# EAGLE design interface (EAGLE 5.04)
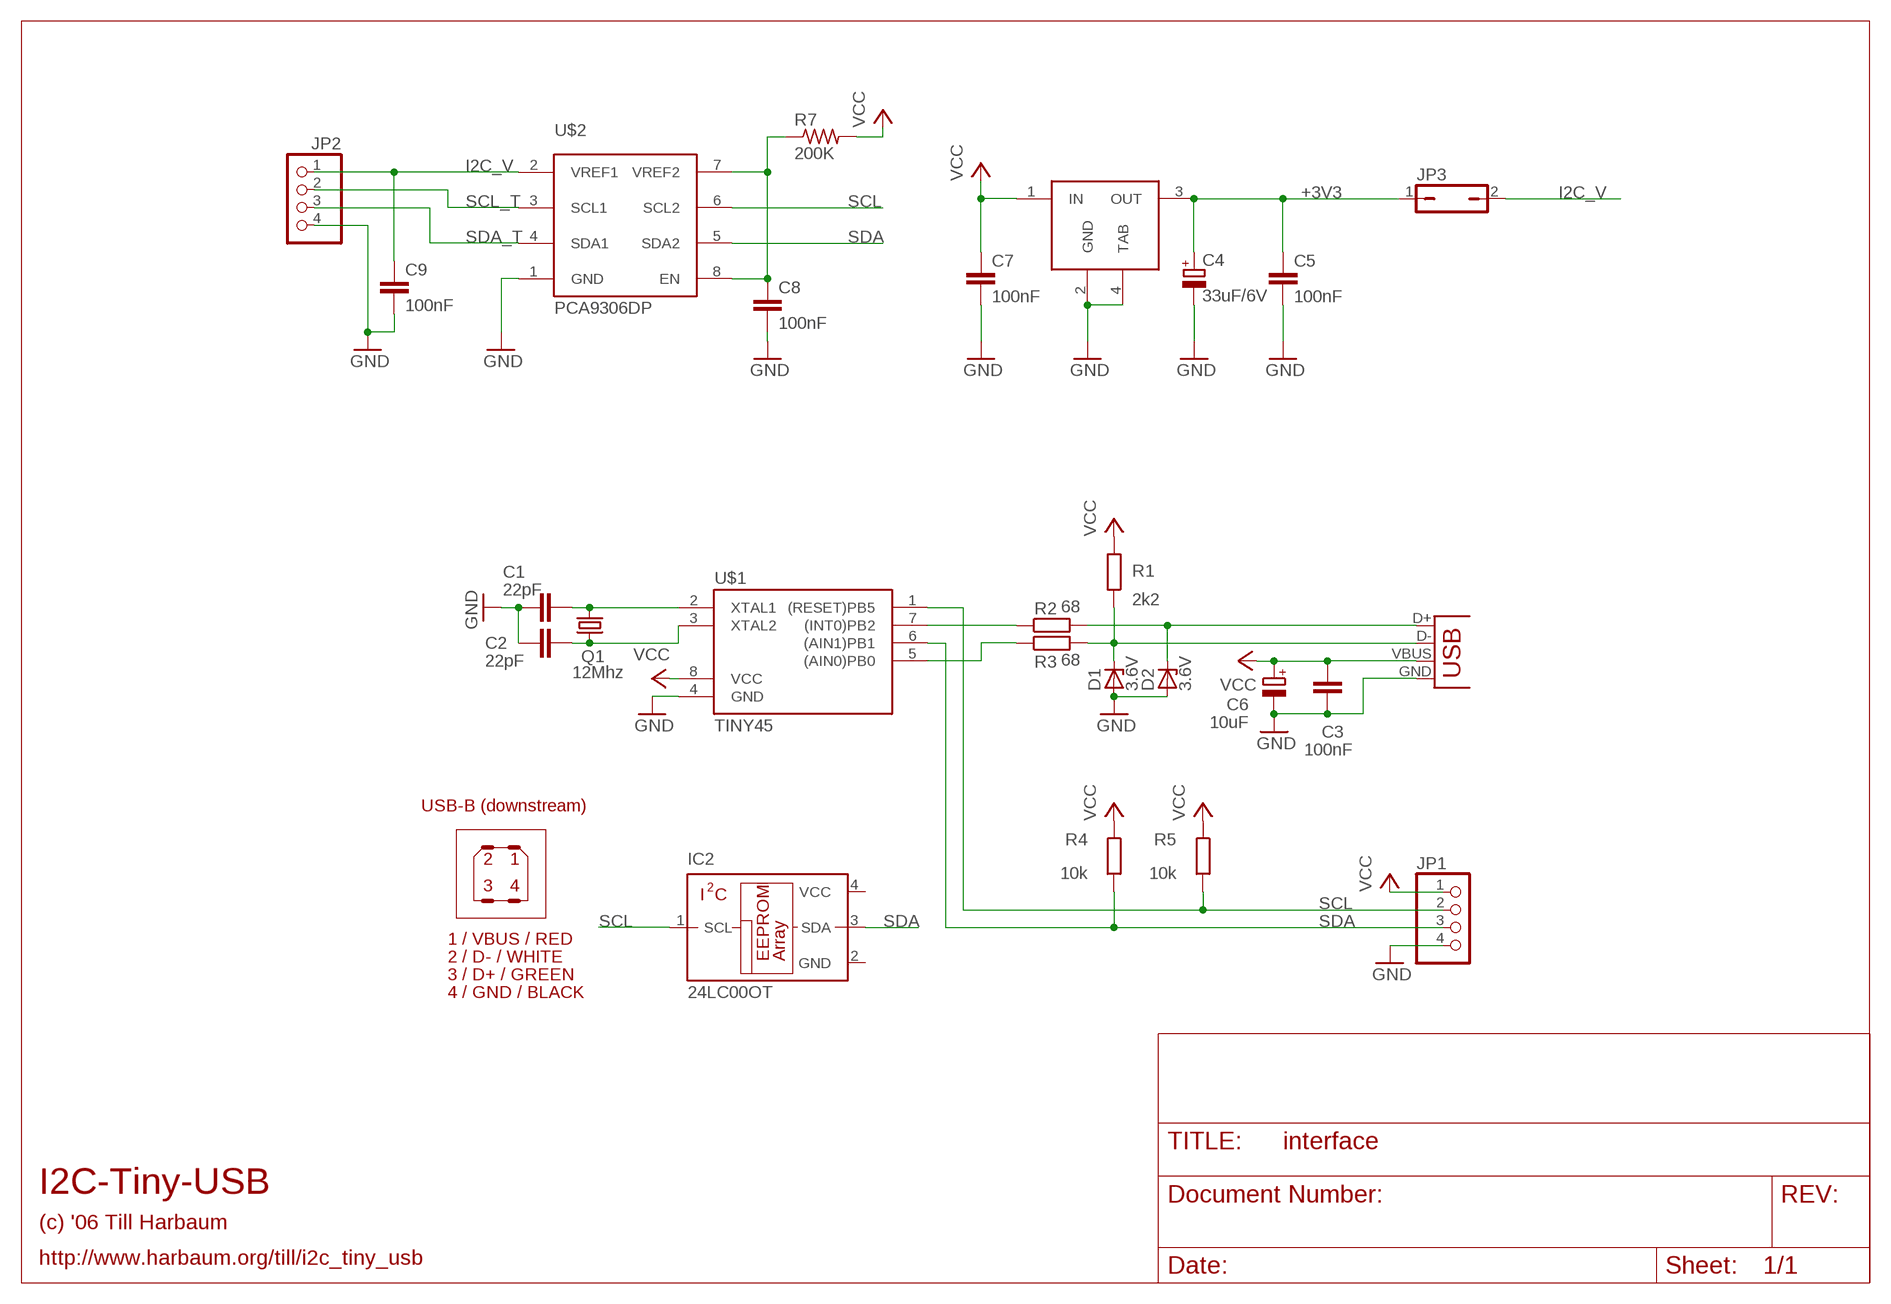
[diagram p0: schematic, sheet 1]

## Parts
C1  22pF  C-EU025-025X050  [C025-025X050]
C2  22pF  C-EU025-025X050  [C025-025X050]
C3  100nF  C-EU050-025X075  [C050-025X075]
C4  33uF/6V  CPOL-EUCT3216  [CT3216]
C5  100nF  C-EUC0603  [C0603]
C6  10uF  CPOL-EUTT2D5L  [TT2D5L]
C7  100nF  C-EUC0603  [C0603]
C8  100nF  C-EUC0603  [C0603]
C9  100nF  C-EUC0603  [C0603]
D1  3.6V  ZENER-DIODEZD-10  [ZDIO-10]
D2  3.6V  ZENER-DIODEZD-10  [ZDIO-10]
IC2  24LC00OT  [SOT23-5L]
JP1  PINHD-1X4  [1X04]
JP2  PINHD-1X4  [1X04]
JP3  JP1Q  [JP1]
Q1  12Mhz  CRYTALHC49S  [HC49/S]
R1  2k2  R-EU_0207/10  [0207/10]
R2  68  R-EU_0207/10  [0207/10]
R3  68  R-EU_0207/10  [0207/10]
R4  10k  R-EU_0207/10  [0207/10]
R5  10k  R-EU_0207/10  [0207/10]
R7  200K  R-US_R0603  [R0603]
U$1  TINY45  [DIL08]
U$2  PCA9306DP  [TSSOP_B3]
U$3  LM3940IMP-3.3  [SOT223-R]
X1  USB-B-H  [USB-B-H]

## Nets
+3V3: C4.+ C5.1 JP3.1 U$3.3(OUT)
GND: C1.1 C2.1 C3.2 C4.- C5.2 C6.- C7.2 C8.2 C9.2 D1.A D2.A JP1.4 JP2.4 U$1.4(GND) U$2.1(GND) U$3.2(GND) U$3.4(TAB) X1.GND
I2C_V: C9.1 JP2.1 JP3.2 U$2.2(VREF1)
N$1: C1.2 Q1.2 U$1.2(XTAL1)
N$2: C2.2 Q1.1 U$1.3(XTAL2)
N$3: D1.C R1.1 R2.2 X1.D-
N$6: D2.C R3.2 X1.D+
N$8: R2.1 U$1.5((AIN0)PB0)
N$9: R3.1 U$1.7((INT0)PB2)
N$69: C8.1 R7.1 U$2.7(VREF2) U$2.8(EN)
SCL: IC2.1(SCL) JP1.2 R5.2 U$1.1((RESET)PB5) U$2.6(SCL2)
SCL_T: JP2.2 U$2.3(SCL1)
SDA: IC2.3(SDA) JP1.3 R4.2 U$1.6((AIN1)PB1) U$2.5(SDA2)
SDA_T: JP2.3 U$2.4(SDA1)
VCC: C3.1 C6.+ C7.1 JP1.1 R1.2 R4.1 R5.1 R7.2 U$1.8(VCC) U$3.1(IN) X1.VBUS

## Notes on the sheet
- USB-B (downstream)
- 2 | 1
- 3 | 4
- 1 / VBUS / RED
- 2 / D- / WHITE
- 3 / D+ / GREEN
- 4 / GND / BLACK
- I2C-Tiny-USB
- (c) '06 Till Harbaum
- http://www.harbaum.org/till/i2c_tiny_usb

## Power pins joined to a net without a drawn wire
GND: IC2.2(GND)
VCC: IC2.4(VCC)

## Library data of the parts
C1-C3 C5 C7-C9 = rcl:C-EU: CAPACITOR, European symbol
C4 C6 = rcl:CPOL-EU: POLARIZED CAPACITOR, European symbol
D1 D2 = diode:ZENER-DIODE: Z-Diode
IC2 = microchip:24*00: Serial EEPROM 128 bit, I2C (AA = 1.8 V/LC = 2.5 V/C = 5.0 V)
JP1 JP2 = pinhead:PINHD-1X4: PIN HEADER
JP3 = jumper:JP1Q: JUMPER
Q1 = crystal:CRYTAL: CRYSTAL
R1-R5 = rcl:R-EU_: RESISTOR, European symbol
R7 = rcl:R-US_: RESISTOR, American symbol
U$1 = avr-1:TINY45
U$2 = booz:PCA9306: Dual bidirectional I2C-bus and SMBus voltage-level translator
U$3 = paparazzi:LM3940IMP-3.3
X1 = con-usb:USB: USB Connectors

## Board
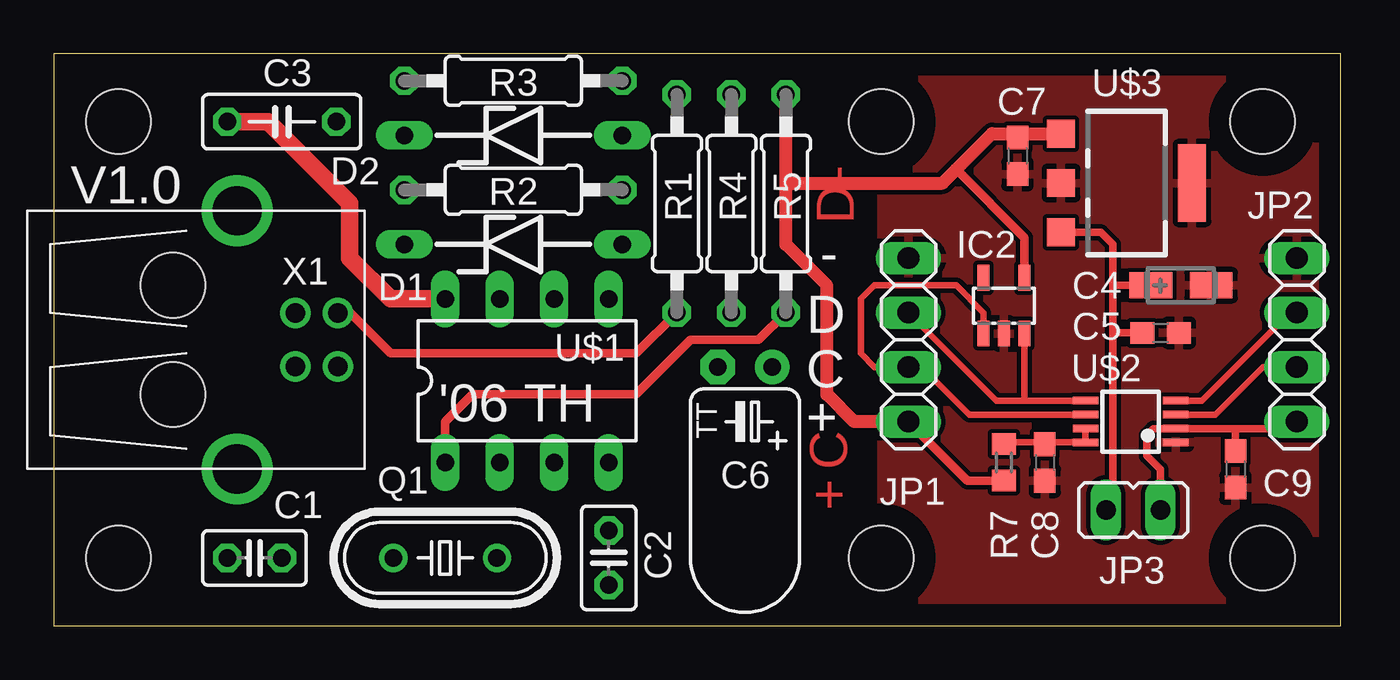
[diagram p1: board, top side]
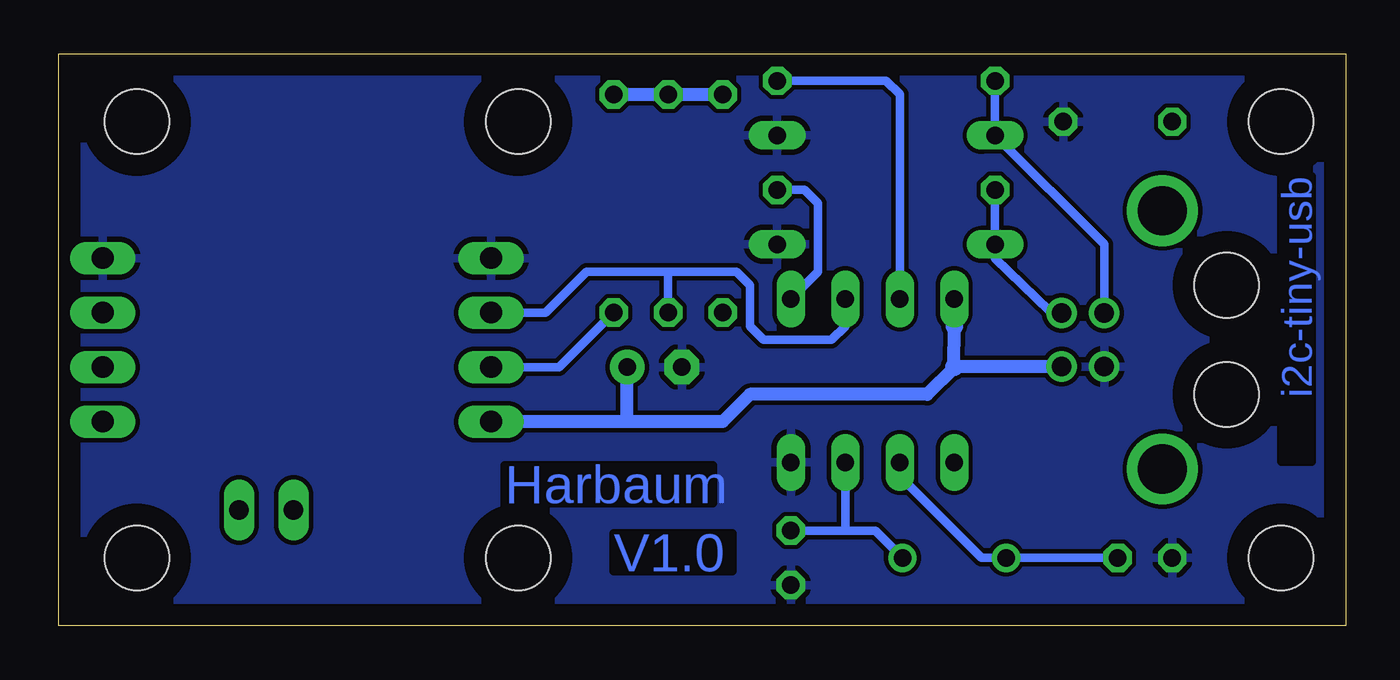
[diagram p2: board, bottom side, seen from below]

Size 59.99 x 26.66 mm. Coordinates in mm from the lower left corner, seen from the top.
Outline: 0,0 59.99,0 59.99,26.66 0,26.66 0,0
Copper layers (1*16): Top 0.035mm / dielectric 1.5mm / Bottom 0.035mm
Design rules "default": minimum track width 10mil, minimum drill 24mil, track to track 8mil, track to pad 8mil, pad to pad 8mil, via to via 8mil, smd to smd 8mil, copper to edge 40mil, drill to drill 8mil, minimum pad ring 10mil, minimum via ring 8mil, stop-mask expansion 4mil, vias tented up to drill 0mil, thermal gap 10mil
Holes 3 mm at 3.01,23.49 3.01,3.17 38.57,3.17 38.57,23.49 56.35,23.49 56.35,3.17 5.55,15.87 5.55,10.79

### Footprints (pad centres in the part's own frame; a part is rotated, then mirrored left to right if it is on the bottom)
C025-025X050 = drill 0.813 octagon: 1 -1.27,0; 2 1.27,0
C050-025X075 = drill 0.813 octagon: 1 -2.54,0; 2 2.54,0
CT3216 = smd 2 x 1.2: + -1.4,0; - 1.4,0
C0603 = smd 1.1 x 1: 1 -0.85,0; 2 0.85,0
TT2D5L = drill 0.813 pad 1.6 round: + -1.27,0 | drill 0.813 pad 1.6 octagon: - 1.27,0
ZDIO-10 = drill 0.813 long: A 5.08,0; C -5.08,0
SOT23-5L = smd 0.55 x 1.2: 1 -0.95,-1.3; 2 0,-1.3; 3 0.95,-1.3; 4 0.95,1.3; 5 -0.95,1.3
1X04 = drill 1.016 long: 1 -3.81,0; 2 -1.27,0; 3 1.27,0; 4 3.81,0
JP1 = drill 0.914 long: 1 0,-1.27; 2 0,1.27
HC49/S = drill 0.813 round: 1 -2.413,0; 2 2.413,0
0207/10 = drill 0.813 octagon: 1 -5.08,0; 2 5.08,0
R0603 = smd 1 x 1.1: 1 -0.85,0; 2 0.85,0
DIL08 = drill 0.813 long: 1 -3.81,-3.81; 2 -1.27,-3.81; 3 1.27,-3.81; 4 3.81,-3.81; 5 3.81,3.81; 6 1.27,3.81; 7 -1.27,3.81; 8 -3.81,3.81
TSSOP_B3 = smd 1.2 x 0.35: 1 -2.925,0.975; 2 -2.925,0.325; 3 -2.925,-0.325; 4 -2.925,-0.975; 5 1.275,-0.975; 6 1.275,-0.325; 7 1.275,0.325; 8 1.275,0.975
SOT223-R = smd 1.3 x 1.3: 1 -2.3,-3.05; 2 0,-3.05; 3 2.3,-3.05 | smd 3.6 x 1.3: 4 0,3.05
USB-B-H = drill 0.914 round: D+ 0,1.25; D- 1.981,1.25; GND 0,-1.25; VBUS 1.981,-1.25 | drill 2.286 round: P$1 -2.718,-6.02; P$2 -2.718,6.02

### Placement (x,y rotation side)
C1  9.36,3.17 0 top
C2  25.87,3.17 90 top
C3  10.63,23.49 0 top
C4  52.54,15.87 0 top
C5  51.59,13.65 0 top
C6  32.22,12.06 180 top
C7  44.92,21.9 270 top
C8  46.19,7.62 270 top
C9  55.08,7.3 270 top
D1  21.42,17.77 0 top
D2  21.42,22.86 0 top
IC2  44.28,14.92 0 top
JP1  39.84,13.33 90 top
JP2  57.94,13.33 90 top
JP3  50.32,5.39 270 top
Q1  18.25,3.17 180 top
R1  29.04,19.68 90 top
R2  21.42,20.31 180 top
R3  21.42,25.39 180 top
R4  31.58,19.68 270 top
R5  34.12,19.68 270 top
R7  44.28,7.62 270 top
U$1  22.06,11.43 0 top
U$2  49.37,9.52 180 top
U$3  50,20.63 270 top
X1  11.27,13.33 0 top

### Tracks (layer width: path | path; a pad name or v marks a point on that pad's centre or on a via)
+3V3
  Top 0.356: U$3.3 48.81,18.33 49.37,17.77 49.37,15.87 | 49.37,13.65 C5.1 | JP3.1 49.37,5.71 49.37,13.65 | 49.37,13.65 49.37,15.87 | 49.37,15.87 C4.+
GND
  pour Bottom: -0.17,26.66 59.84,26.35 59.84,-0.01 0.47,-0.01 -0.17,0.63
  pour Top: 38.57,26.66 59.84,26.66 59.84,-0.01 38.57,-0.01
I2C_V
  Top 0.305: U$2.2
  Top 0.356: 55.08,9.2 U$2.2 51.26,9.2 50.95,8.89 50.95,7.93 51.59,7.3 JP3.2 | 55.08,9.2 57.61,9.2 JP2.1 | 55.08,9.2 C9.1
N$1
  Bottom 0.406: C1.2 15.71,3.17 | U$1.2 20.79,6.98 16.98,3.17 15.71,3.17 | 15.71,3.17 Q1.2
N$2
  Bottom 0.406: Q1.1 21.93,4.44 23.33,4.44 | 23.33,4.44 C2.2 | 23.33,4.44 U$1.3
N$3
  Top 0.406: X1.D- 13.83,14.58 15.71,12.7 27.14,12.7 R1.1
  Bottom 0.406: X1.D- 13.81,14.66 16.34,17.14 D1.C R2.2
N$6
  Bottom 0.406: X1.D+ 11.27,17.77 D2.C R3.2
N$8
  Bottom 0.406: U$1.5 24.6,16.5 24.6,19.68 25.23,20.31 R2.1
N$9
  Bottom 0.406: U$1.7 20.79,24.76 21.42,25.39 R3.1
N$69
  Top 0.305: U$2.7 U$2.8 46.19,8.54 | 46.19,8.54 44.37,8.54 arc90 R7.1 | 46.19,8.54 C8.1
SCL
  Top 0.305: 43.34,14.28 IC2.1 43.34,14.6 42.06,15.87 38.25,15.87 37.62,15.24 37.62,12.7 38.25,12.06 JP1.2 40.48,12.06 42.69,9.85 U$2.6
  Top 0.406: U$1.1 18.25,9.52 19.52,10.79 27.14,10.79 29.68,13.33 32.85,13.33 R5.2
  Bottom 0.406: R5.2 36.66,12.06 JP1.2
SCL_T
  Top 0.305: U$2.3 54.13,9.85 56.35,12.06 JP2.2
SDA
  Top 0.305: 45.24,10.5 43.95,10.5 JP1.3 | 45.24,10.5 U$2.5 | IC2.3 45.23,10.5 45.24,10.5
  Bottom 0.406: 31.58,16.5 R4.2 | 31.58,16.5 28.41,16.5 27.77,15.87 27.77,13.97 27.14,13.33 23.96,13.33 23.33,13.97 U$1.6 | 31.58,16.5 35.39,16.5 37.3,14.6 JP1.3
SDA_T
  Top 0.305: U$2.4 53.52,10.5 57.62,14.6 JP2.3
VCC
  Top 0.406: R7.2 42.59,6.76 JP1.1 | IC2.4 45.23,18.09 42.06,21.27
  Top 0.61: 34.12,20.63 34.12,17.77 36.03,15.87 36.03,10.79 37.3,9.52 JP1.1 | 34.12,20.63 R5.1 | 34.12,20.63 41.43,20.63 42.06,21.27 43.73,22.93 44.92,22.93 | 44.92,22.93 U$3.1 | 44.92,22.93 C7.1
  Top 0.813: C3.1 10,23.49 13.81,19.68 13.81,17.14 15.71,15.24 U$1.8
  Bottom 0.61: R1.2 R4.1 R5.1 | X1.VBUS 18.25,12.08 | 18.27,12.08 18.25,13.97 | 33.49,9.52 JP1.1 | 33.49,9.52 29.04,9.52 27.77,10.79 19.52,10.79 18.25,12.06 | 33.49,9.52 C6.+
  Bottom 0.813: 18.27,12.08 18.25,12.08 18.25,12.06 | 18.25,13.97 U$1.8

### Text on the board
Top: - | D | C | +
Bottom: i2c-tiny-usb | Harbaum | V1.0
tNames: V1.0 | - | D | C | '06 TH | +